# Altium schematic sheet Raspberry.SchDoc
size A1
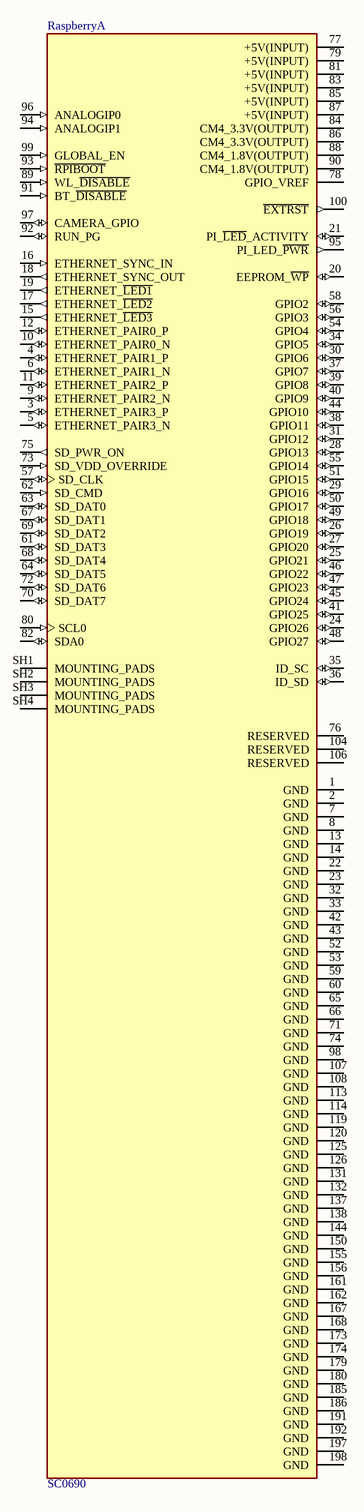
[diagram p0: Raspberry.SchDoc]

## Parts
Raspberry  SC0690  [MODULE_SC0690]  (part A of 2)

## Nets

Not connected (* = marked no-connect by the designer): Raspberry 1(GND) 2(GND) 3(ETHERNET_PAIR3_P) 4(ETHERNET_PAIR1_P) 5(ETHERNET_PAIR3_N) 6(ETHERNET_PAIR1_N) 7(GND) 8(GND) 9(ETHERNET_PAIR2_N) 10(ETHERNET_PAIR0_N) 11(ETHERNET_PAIR2_P) 12(ETHERNET_PAIR0_P) 13(GND) 14(GND) 15(ETHERNET_~{LED3}) 16(ETHERNET_SYNC_IN) 17(ETHERNET_~{LED2}) 18(ETHERNET_SYNC_OUT) 19(ETHERNET_~{LED1}) 20(EEPROM_~{WP}) 21(PI_~{LED}_ACTIVITY) 22(GND) 23(GND) 24(GPIO26) 25(GPIO21) 26(GPIO19) 27(GPIO20) 28(GPIO13) 29(GPIO16) 30(GPIO6) 31(GPIO12) 32(GND) 33(GND) 34(GPIO5) 35(ID_SC) 36(ID_SD) 37(GPIO7) 38(GPIO11) 39(GPIO8) 40(GPIO9) 41(GPIO25) 42(GND) 43(GND) 44(GPIO10) 45(GPIO24) 46(GPIO22) 47(GPIO23) 48(GPIO27) 49(GPIO18) 50(GPIO17) 51(GPIO15) 52(GND) 53(GND) 54(GPIO4) 55(GPIO14) 56(GPIO3) 57(SD_CLK) 58(GPIO2) 59(GND) 60(GND) 61(SD_DAT3) 62(SD_CMD) 63(SD_DAT0) 64(SD_DAT5) 65(GND) 66(GND) 67(SD_DAT1) 68(SD_DAT4) 69(SD_DAT2) 70(SD_DAT7) 71(GND) 72(SD_DAT6) 73(SD_VDD_OVERRIDE) 74(GND) 75(SD_PWR_ON) 76(RESERVED) 77(+5V(INPUT)) 78(GPIO_VREF) 79(+5V(INPUT)) 80(SCL0) 81(+5V(INPUT)) 82(SDA0) 83(+5V(INPUT)) 84(CM4_3.3V(OUTPUT)) 85(+5V(INPUT)) 86(CM4_3.3V(OUTPUT)) 87(+5V(INPUT)) 88(CM4_1.8V(OUTPUT)) 89(WL_~{DISABLE}) 90(CM4_1.8V(OUTPUT)) 91(BT_~{DISABLE}) 92(RUN_PG) 93(~{RPIBOOT}) 94(ANALOGIP1) 95(PI_LED_~{PWR}) 96(ANALOGIP0) 97(CAMERA_GPIO) 98(GND) 99(GLOBAL_EN) 100(~{EXTRST}) 104(RESERVED) 106(RESERVED) 107(GND) 108(GND) 113(GND) 114(GND) 119(GND) 120(GND) 125(GND) 126(GND) 131(GND) 132(GND) 137(GND) 138(GND) 144(GND) 150(GND) 155(GND) 156(GND) 161(GND) 162(GND) 167(GND) 168(GND) 173(GND) 174(GND) 179(GND) 180(GND) 185(GND) 186(GND) 191(GND) 192(GND) 197(GND) 198(GND) SH1(MOUNTING_PADS) SH2(MOUNTING_PADS) SH3(MOUNTING_PADS) SH4(MOUNTING_PADS)

## Library data of the parts
Raspberry = SC0690: MF: {'manufacturer': u'Raspberry Pi'}; Package: None; Price: None; Value: *; MP: SC0690; Availability: Unavailable